# EAGLE design meter-sensor-IC (EAGLE 6.4)
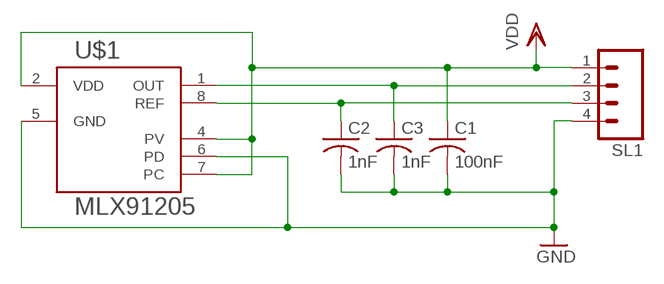
[diagram p0: schematic, sheet 1]

## Parts
C1  100nF  C-US050-024X044  [C050-024X044]
C2  1nF  C-US025-024X044  [C025-024X044]
C3  1nF  C-US025-024X044  [C025-024X044]
SL1  M04  [04P]
U$1  MLX91205  [SO08]

## Nets
GND: C1.2 C2.2 C3.2 SL1.4 U$1.5(GND) U$1.6(PD)
N$5: C3.1 SL1.2 U$1.1(OUT)
N$8: C2.1 SL1.3 U$1.8(REF)
VDD: C1.1 SL1.1 U$1.2(VDD) U$1.4(PV) U$1.7(PC)

## Library data of the parts
C1-C3 = adafruit:C-US: CAPACITOR, American symbol
SL1 = con-amp-quick:M04: AMP QUICK CONNECTOR; OC_FARNELL: unknown; OC_NEWARK: unknown
U$1 = serge:MLX91205

## Board
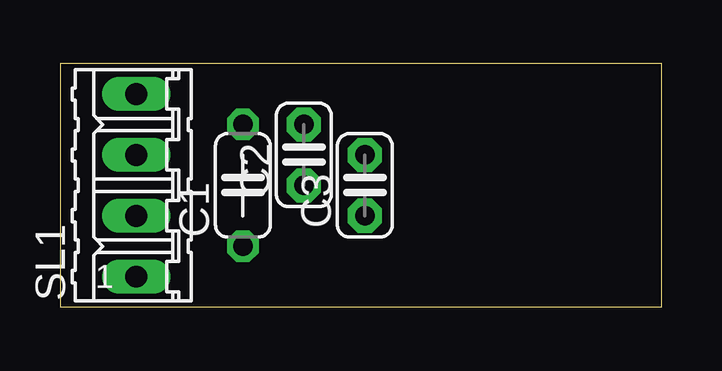
[diagram p1: board, top side]
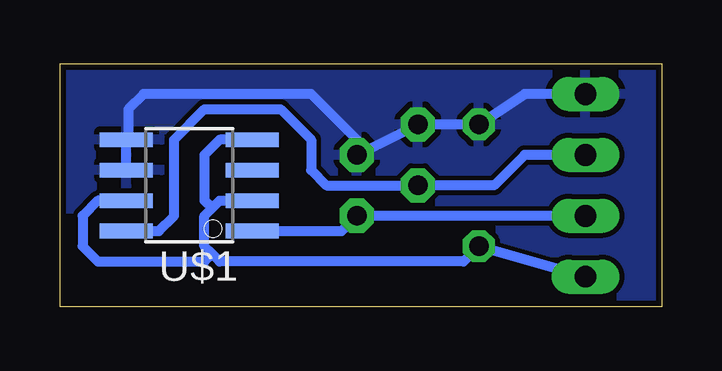
[diagram p2: board, bottom side, seen from below]

Size 25.07 x 10.15 mm. Coordinates in mm from the lower left corner, seen from the top.
Outline: 0,0 25.07,0 25.07,10.15 0,10.15 0,0
Copper layers (1*16): Top 0.035mm / dielectric 1.5mm / Bottom 0.035mm
Design rules "default *": minimum track width 10mil, minimum drill 24mil, track to track 8mil, track to pad 8mil, pad to pad 8mil, via to via 8mil, smd to smd 8mil, copper to edge 10mil, drill to drill 8mil, minimum pad ring 10mil, minimum via ring 8mil, stop-mask expansion 4mil, vias tented up to drill 0mil, thermal gap 10mil

### Footprints (pad centres in the part's own frame; a part is rotated, then mirrored left to right if it is on the bottom)
C050-024X044 = drill 0.813 octagon: 1 -2.54,0; 2 2.54,0
C025-024X044 = drill 0.813 pad 1.422 octagon: 1 -1.27,0; 2 1.27,0
04P = drill 0.914 long: 1 -3.81,0; 2 -1.27,0; 3 1.27,0; 4 3.81,0
SO08 = smd 0.61 x 2.21: 1 -1.905,-2.616; 2 -0.635,-2.616; 3 0.635,-2.616; 4 1.905,-2.616; 5 1.905,2.616; 6 0.635,2.616; 7 -0.635,2.616; 8 -1.905,2.616

### Placement (x,y rotation side)
C1  7.62,5.08 90 top
C2  10.16,6.35 90 top
C3  12.7,5.08 90 top
SL1  3.17,5.08 90 top
U$1  19.68,5.08 90 bottom

### Tracks (layer width: path | path; a pad name or v marks a point on that pad's centre or on a via)
GND
  Bottom 0.406: SL1.4 5.71,8.89 C1.2 C2.2 C3.2 12.7,6.99 14.61,8.89 21.59,8.89 22.23,8.26 22.23,7.06 U$1.5 U$1.6
  pour Bottom: 0,10.16 25.4,10.16 25.4,0 0,0
N$5
  Bottom 0.406: SL1.2 C3.1 13.34,3.17 U$1.1
N$8
  Bottom 0.406: SL1.3 5.71,6.35 6.99,5.08 C2.1 13.97,5.08 14.61,5.71 14.61,6.99 15.88,8.26 19.05,8.26 20.32,6.99 20.32,3.81 20.95,3.17 U$1.8
VDD
  Bottom 0.406: SL1.1 C1.1 8.26,1.91 18.41,1.91 18.73,2.22 | 18.73,2.22 19.05,2.54 19.05,3.81 18.73,4.13 | 18.73,4.13 18.41,4.45 U$1.2 | U$1.4 18.41,6.99 19.05,6.35 19.05,4.45 18.73,4.13 | U$1.7 23.5,4.45 24.13,3.81 24.13,2.54 23.5,1.91 19.05,1.91 18.73,2.22